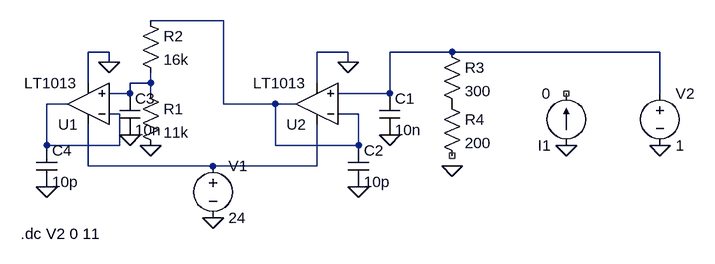
[diagram p0: schematic analog_in.asc]
analog_in.asc, the LTspice schematic file:
Version 4
SHEET 1 1012 680
WIRE 224 0 112 0
WIRE 48 48 16 48
WIRE 416 48 368 48
WIRE 576 48 480 48
WIRE 896 48 576 48
WIRE 48 64 48 48
WIRE 416 64 416 48
WIRE 16 96 16 48
WIRE 112 96 112 80
WIRE 112 96 80 96
WIRE 368 96 368 48
WIRE 80 112 80 96
WIRE 80 112 48 112
WIRE 112 112 112 96
WIRE 480 112 480 48
WIRE 480 112 400 112
WIRE 896 112 896 48
WIRE -16 128 -48 128
WIRE 224 128 224 0
WIRE 304 128 224 128
WIRE 336 128 304 128
WIRE 64 144 48 144
WIRE 432 144 400 144
WIRE -48 192 -48 128
WIRE 64 192 64 144
WIRE 64 192 -48 192
WIRE 304 192 304 128
WIRE 432 192 432 144
WIRE 432 192 304 192
WIRE 16 224 16 160
WIRE 208 224 16 224
WIRE 368 224 368 160
WIRE 368 224 208 224
FLAG 112 192 0
FLAG 208 304 0
FLAG 48 64 0
FLAG 416 64 0
FLAG 752 192 0
FLAG 896 192 0
FLAG 576 224 0
FLAG 80 176 0
FLAG 432 256 0
FLAG 480 176 0
FLAG -48 256 0
SYMBOL OpAmps\\LT1013 16 192 R180
SYMATTR InstName U1
SYMBOL OpAmps\\LT1013 368 192 R180
SYMATTR InstName U2
SYMBOL res 96 96 R0
SYMATTR InstName R1
SYMATTR Value 11k
SYMBOL res 96 -16 R0
SYMATTR InstName R2
SYMATTR Value 16k
SYMBOL voltage 208 208 R0
WINDOW 123 0 0 Left 0
WINDOW 39 0 0 Left 0
SYMATTR InstName V1
SYMATTR Value 24
SYMBOL voltage 896 96 R0
WINDOW 123 0 0 Left 0
WINDOW 39 0 0 Left 0
SYMATTR InstName V2
SYMATTR Value 1
SYMBOL current 752 192 R180
WINDOW 123 0 0 Left 0
WINDOW 39 0 0 Left 0
SYMATTR InstName I1
SYMATTR Value 0
SYMBOL res 560 32 R0
SYMATTR InstName R3
SYMATTR Value 300
SYMBOL res 560 112 R0
SYMATTR InstName R4
SYMATTR Value 200
SYMBOL cap 464 112 R0
SYMATTR InstName C1
SYMATTR Value 10n
SYMBOL cap 416 192 R0
SYMATTR InstName C2
SYMATTR Value 10p
SYMBOL cap 64 112 R0
SYMATTR InstName C3
SYMATTR Value 10n
SYMBOL cap -64 192 R0
SYMATTR InstName C4
SYMATTR Value 10p
TEXT -88 328 Left 2 !.dc V2 0 11

The netlist it stands for:
* analog_in.asc
XU1 N003 N004 N005 0 N004 LT1013  ; pins In+ In- V+ V- OUT
XU2 N002 N001 N005 0 N001 LT1013  ; pins In+ In- V+ V- OUT
R1 N003 0 11k
R2 N001 N003 16k
V1 N005 0 24
V2 N002 0 1
I1 0 NC_01 0
R3 N002 P001 300
R4 P001 NC_02 200
C1 N002 0 10n
C2 N001 0 10p
C3 N003 0 10n
C4 N004 0 10p
.dc V2 0 11
.lib LTC.lib
.backanno
.end